# EAGLE design busbar (EAGLE 6.5.0)
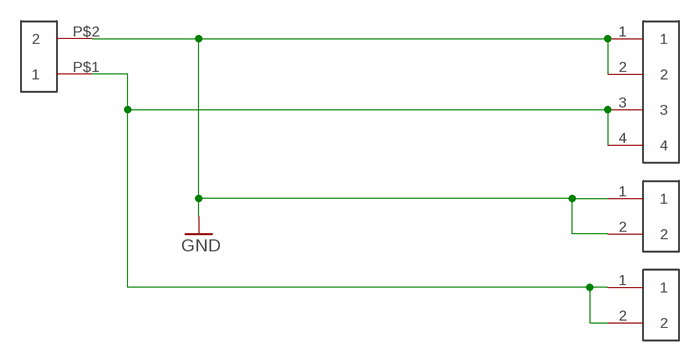
[diagram p0: schematic, sheet 1]

## Parts
U$1  MOLEX-0436500200  [MOLEX_MICROFIT-2]
U$2  1X4_HEADER  [1X4-.1HEADER]
U$3  1X2_HEADER  [1X2-.1HEADER]
U$4  1X2_HEADER  [1X2-.1HEADER]

## Nets
GND: U$1.P$2 U$2.1 U$2.2 U$3.1 U$3.2
VBUS: U$1.P$1 U$2.3 U$2.4 U$4.1 U$4.2

## Library data of the parts
U$1 = connectors:MOLEX-0436500200
U$2 = connectors:1X4_HEADER
U$3 U$4 = connectors:1X2_HEADER

## Board
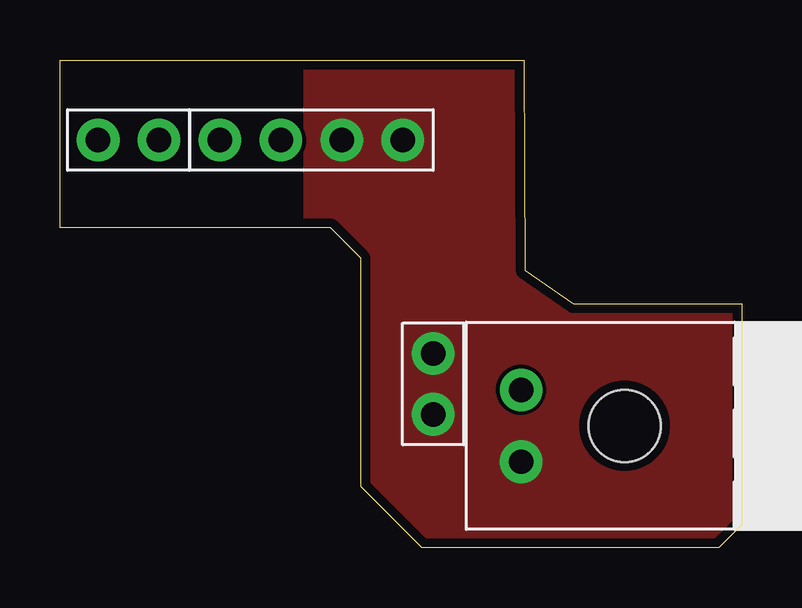
[diagram p1: board, top side]
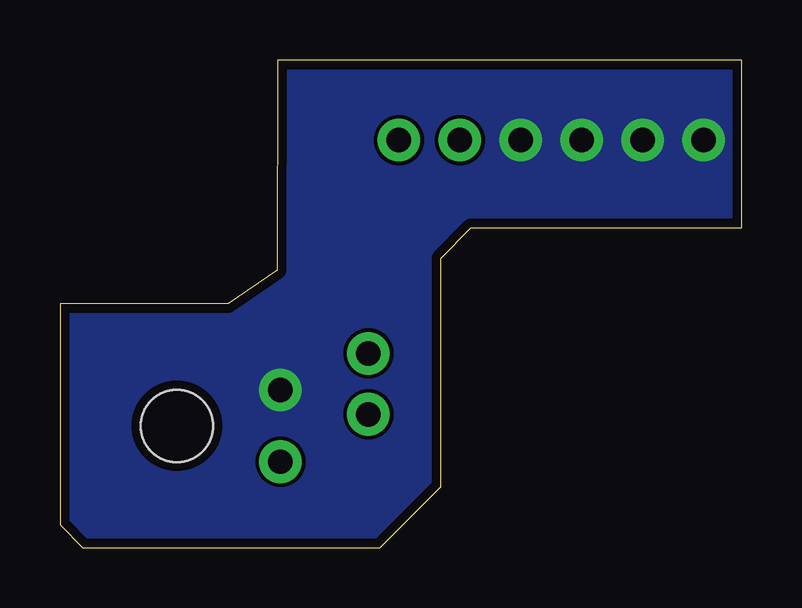
[diagram p2: board, bottom side, seen from below]

Size 28.42 x 20.32 mm. Coordinates in mm from the lower left corner, seen from the top.
Outline: 0,13.33 0,20.32 19.35,20.32 19.38,11.57 21.41,10.16 28.42,10.16 28.42,0.95 27.47,0 15.08,0 12.54,2.54 12.54,12.06 11.27,13.33 0,13.33
Copper layers (1*16): Top 0.0356mm / dielectric 1.5011mm / Bottom 0.0356mm
Design rules "oshpark": minimum track width 6mil, minimum drill 13mil, track to track 6mil, track to pad 6mil, pad to pad 6mil, via to via 6mil, smd to smd 6mil, copper to edge 15mil, drill to drill 6mil, minimum pad ring 7mil, minimum via ring 7mil, stop-mask expansion 4mil, vias tented up to drill 0mil, thermal gap 10mil

### Footprints (pad centres in the part's own frame; a part is rotated, then mirrored left to right if it is on the bottom)
MOLEX_MICROFIT-2 = drill 1.016 pad 1.778: P$1 -1.499,4.318; P$2 1.499,4.318 | hole 2.997: 0,0
1X4-.1HEADER = drill 1.016 pad 1.778: 1 -5.08,0; 2 -2.54,0; 3 0,0; 4 2.54,0
1X2-.1HEADER = drill 1.016 pad 1.778: 1 -2.54,0; 2 0,0

### Placement (x,y rotation side)
U$1  23.55,5.08 90 top
U$2  11.75,16.99 0 top
U$3  4.13,16.99 0 top
U$4  15.56,5.56 270 top

### Tracks (layer width: path | path; a pad name or v marks a point on that pad's centre or on a via)
GND
  pour Bottom (no thermals): 0.01,20.32 19.35,20.32 19.38,11.57 21.41,10.16 28.42,10.16 28.42,0.95 27.47,0 15.08,0 12.54,2.54 12.54,12.06 11.27,13.33 0.01,13.33
VBUS
  pour Top (no thermals): 10.27,20.32 19.35,20.32 19.38,11.57 21.41,10.16 28.42,10.16 28.42,0.95 27.47,0 15.08,0 12.54,2.54 12.54,12.06 11.27,13.33 10.27,13.33